# Altium project The_Robot.PrjPcb (part 1 of 2)
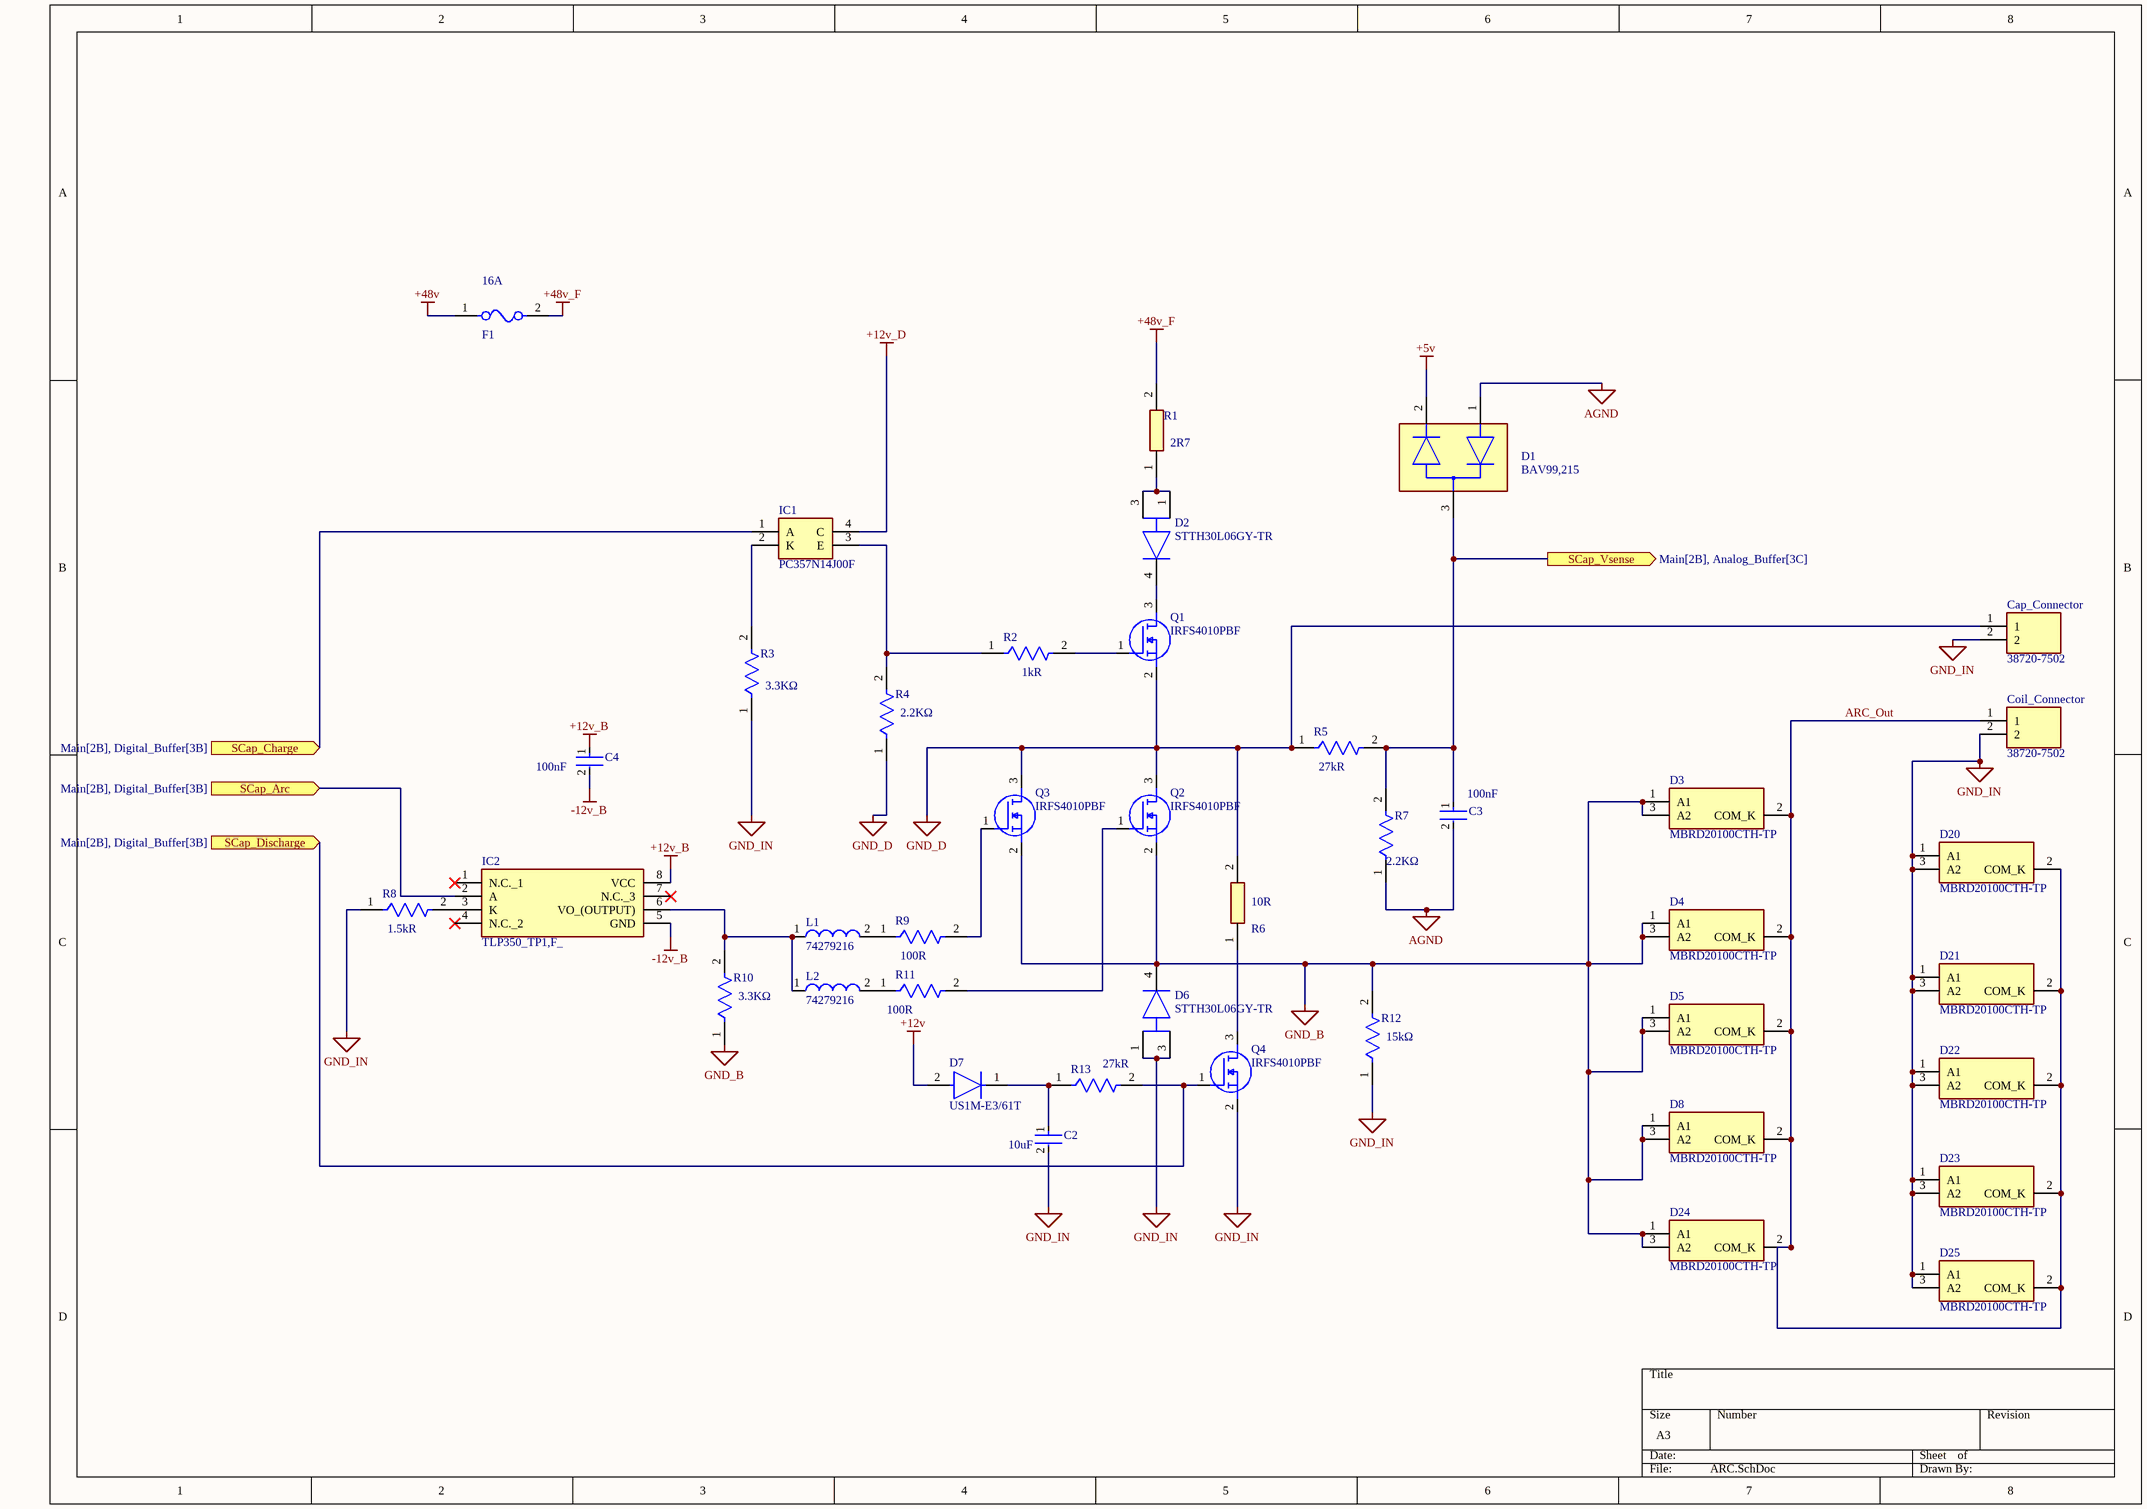
[diagram p0: ARC.SchDoc]
5 sheets, 205 parts. Net scope: hierarchical (ports join the sheet entries above them; power ports are global).
Board file: PCB2.PcbDoc
Sheets:
  ARC.SchDoc
  Power.SchDoc
  Microcontroller.SchDoc
  Digital_Buffer.SchDoc
  Analog_Buffer.SchDoc

## Sheet ARC.SchDoc
size A3; SheetNumber: 2; SheetTotal: 6

### Parts
C2  Capacitance: 10uF  [FP-GRM31C-0_2-e0_3_0_8-MFG]  (hidden comment: GRM31CR71E106KA12L)
C3  Capacitance: 100nF  [FP-1206-L_3_2_0_2-W_1_6_0-MFG]  (hidden comment: 12065C104KAT2A)
C4  Capacitance: 100nF  [FP-1206-L_3_2_0_2-W_1_6_0-MFG]  (hidden comment: 12065C104KAT2A)
Cap_Connector  38720-7502  [387207502]
Coil_Connector  38720-7502  [387207502]
D1  BAV99,215  [FP-SOT23-MFG]
D2  STTH30L06GY-TR  [FP-D2PAK-MFG]
D3  MBRD20100CTH-TP  [MBRD20100CTHTP]
D4  MBRD20100CTH-TP  [MBRD20100CTHTP]
D5  MBRD20100CTH-TP  [MBRD20100CTHTP]
D6  STTH30L06GY-TR  [FP-D2PAK-MFG]
D7  US1M-E3/61T  [FP-95400-MFG]
D8  MBRD20100CTH-TP  [MBRD20100CTHTP]
D20  MBRD20100CTH-TP  [MBRD20100CTHTP]
D21  MBRD20100CTH-TP  [MBRD20100CTHTP]
D22  MBRD20100CTH-TP  [MBRD20100CTHTP]
D23  MBRD20100CTH-TP  [MBRD20100CTHTP]
D24  MBRD20100CTH-TP  [MBRD20100CTHTP]
D25  MBRD20100CTH-TP  [MBRD20100CTHTP]
F1  Fuse Current: 16A  [FP-0031_8231-MFG]  (hidden comment: 0031.8231)
IC1  PC357N14J00F  [SOP254P675X300-4N]
IC2  TLP350_TP1,F_  [DIP762W60P254L966H485Q8N]
L1  74279216  [SMD-1206]
L2  74279216  [SMD-1206]
Q1  IRFS4010PBF  [IDB30E60]
Q2  IRFS4010PBF  [IDB30E60]
Q3  IRFS4010PBF  [IDB30E60]
Q4  IRFS4010PBF  [IDB30E60]
R1  value 2R7  [CP001027K00JE663]  (hidden comment: CP001010R00JE66)
R2  Resistance: 1kR  [FP-CR1206-IPC_A]  (hidden comment: CR1206-FX-1001ELF)
R3  value 3.3KΩ  [FP-CRGCQ1206-IPC_C]  (hidden comment: CRGCQ1206J3K3)
R4  value 2.2KΩ  [FP-CRGCQ1206-IPC_C]  (hidden comment: CRGCQ1206J2K2)
R5  Resistance: 27kR  [FP-RC3216-IPC_A]  (hidden comment: RC3216J273CS)
R6  value 10R  [CP001027K00JE663]  (hidden comment: CP001010R00JE66)
R7  value 2.2KΩ  [FP-CRGCQ1206-IPC_C]  (hidden comment: CRGCQ1206J2K2)
R8  Resistance: 1.5kR  [FP-CRCW1206-e3-IPC_C]  (hidden comment: CRCW12061K50FKEA)
R9  Resistance: 100R  [FP-CRCW1206-e3-MFG]  (hidden comment: CRCW1206100RFKEA)
R10  Resistance: 3.3KΩ  [FP-CRGCQ1206-IPC_C]  (hidden comment: CRGCQ1206F3K3)
R11  Resistance: 100R  [FP-CRCW1206-e3-MFG]  (hidden comment: CRCW1206100RFKEA)
R12  Resistance: 15kΩ  [FP-ERJ8EN-MFG]  (hidden comment: ERJ-8ENF1502V)
R13  Resistance: 27kR  [FP-RC3216-IPC_A]  (hidden comment: RC3216J273CS)

### Ports
SCap_Arc (in, see Main[2B], Digital_Buffer[3B]), SCap_Charge (in, see Main[2B], Digital_Buffer[3B]), SCap_Discharge (in, see Main[2B], Digital_Buffer[3B]), SCap_Vsense (out, see Main[2B], Analog_Buffer[3C])

### Nets
+5v: D1.2
+12v: D7.2(A)
+12v_B: C4.1 IC2.8(VCC)
+12v_D: IC1.4(C)
+48v: F1.1
+48v_F: F1.2 R1.2
-12v_B: C4.2 IC2.5(GND)
AGND: C3.2 D1.1 R7.1
GND_B: D3.1(A1) D3.3(A2) D4.1(A1) D4.3(A2) D5.1(A1) D5.3(A2) D6.4(K) D8.1(A1) D8.3(A2) D24.1(A1) D24.3(A2) Q2.2(S) Q3.2(S) R10.1 R12.2
GND_D: Cap_Connector.1 Q1.2(S) Q2.3(D) Q3.3(D) R4.1 R5.1 R6.2
GND_IN: C2.2 Cap_Connector.2 Coil_Connector.2 D6.1(A) D6.3(A) D20.1(A1) D20.3(A2) D21.1(A1) D21.3(A2) D22.1(A1) D22.3(A2) D23.1(A1) D23.3(A2) D25.1(A1) D25.3(A2) Q4.2(S) R3.1 R8.1 R12.1
ARC_Out: Coil_Connector.1 D3.2(COM_K) D4.2(COM_K) D5.2(COM_K) D8.2(COM_K) D20.2(COM_K) D21.2(COM_K) D22.2(COM_K) D23.2(COM_K) D24.2(COM_K) D25.2(COM_K)
SCap_Arc: IC2.2(A) ; port SCap_Arc
SCap_Charge: IC1.1(A) ; port SCap_Charge
SCap_Discharge: Q4.1(G) R13.2 ; port SCap_Discharge
SCap_Vsense: C3.1 D1.3 R5.2 R7.2 ; port SCap_Vsense
NetC2_1: C2.1 D7.1(C) R13.1
NetD2_1: D2.1(A) D2.3(A) R1.1
NetD2_4: D2.4(K) Q1.3(D)
NetIC1_2: IC1.2(K) R3.2
NetIC1_3: IC1.3(E) R2.1 R4.2
NetIC2_3: IC2.3(K) R8.2
NetIC2_6: IC2.6(VO_(OUTPUT)) L1.1 L2.1 R10.2
NetL1_2: L1.2 R9.1
NetL2_2: L2.2 R11.1
NetQ1_1: Q1.1(G) R2.2
NetQ2_1: Q2.1(G) R11.2
NetQ3_1: Q3.1(G) R9.2
NetQ4_3: Q4.3(D) R6.1

Not connected (* = marked no-connect by the designer): IC2 1(N.C._1)* 4(N.C._2)* 7(N.C._3)*

### Library data of the parts
C2 = CMP-06035-003589-1: Chip Multilayer Ceramic Capacitors for General Purpose, 1206, 10uF, X7R, 15%, 10%, 25V; Case Code (Imperial): 1206; Voltage Rating (DC): 25V; Voltage Rating: 25V; Length: 3.2mm; Lead Free: Lead Free; Thickness: 0.071inch; Package Quantity: 1; Width: 1.6mm; Max Operating Temperature: 125°C; Number of Pins: 2; Height: 1.6mm; Case Code (Metric): 3216; REACH SVHC: No SVHC; Radiation Hardening: No; Case/Package: 1206; Material: Ceramic; Tolerance: 10%; Voltage: 25V; Mount: Surface Mount; Packaging: Tape and Reel; Dielectric: X7R; Termination: SMD/SMT; Min Operating Temperature: -55°C; Depth: 1.6mm
C3 C4 = CMP-2000-05018-2: General Purpose Ceramic Capacitor, 1206, 100nF, 10%, X7R, 15%, 50V; Dissipation Factor: 2.5%; Insulation Resistance: 100GR; Dielectric: X7R; Thickness: 0.037inch; Case Code (Imperial): 1206; Case Code (Metric): 3216; Dielectric Material: Ceramic; Width: 1.6mm; Voltage Rating (DC): 50V; Termination: SMD/SMT; Tolerance: 10%; REACH SVHC: No SVHC; Height: 0.94mm; Length: 3.2mm; Voltage: 50V; Packaging: Tape and Reel; Depth: 1.6mm; Voltage Rating: 50V; Series: -; Contact Plating: Tin; Mount: Surface Mount; Package Quantity: 1; Construction: Flat; Max Operating Temperature: 125°C; Min Operating Temperature: -55°C; Case/Package: 1206; Lead Free: Lead Free; RoHS Compliant: Yes; Number of Pins: 2; Radiation Hardening: No
Cap_Connector Coil_Connector = 38720-7502: Connector; Manufacturer_Name: Molex; Datasheet Link: https://componentsearchengine.com/Datasheets/2/38720-7502.pdf; Height: 16.8mm; Manufacturer_Part_Number: 38720-7502; Mouser Part Number: 538-38720-7502; Mouser Price/Stock: https://www.mouser.co.uk/ProductDetail/Molex/38720-7502?qs=u6Gr9%2FNt%252B%2F8PORak8KlQTw%3D%3D
D1 = CMP-14399-000006-1: DIODE ARRAY GP 100V 215MA SOT23
D2 D6 = CMP-12188-000013-1: DIODE GEN PURP 600V 30A D2PAK; Manufacturer: STMicroelectronics; Automotive Grade: Grade 0; Max Junction Temp: +175°C; Standoff Height: 0.03mm; Max Surge Forward Current: 300A; Peak Reverse Current: 25uA; RoHS: TRUE; Temperature Range High: +175°C; ComponentLink2Description: Datasheet; Octopart: https://octopart.com/stth30l06gy-tr-stmicroelectronics-26451410; Manufacturer Part Number: STTH30L06GY-TR; Device Class L2: Diodes; Forward Current: 30A; Device Class L3: Rectifier Diodes; Digikey Description: DIODE GEN PURP 600V 30A D2PAK; Temperature: -40°C to +175°C; Temperature Range Low: -40°C; Max Repetitive Reverse Voltage: 600V; Category: Diode; Automotive: Yes; Package: D2PAK; Lead Free: Yes; Height: 4.83mm; Device Class L1: Discrete Semiconductors; ComponentLink2URL: https://www.st.com/resource/en/datasheet/stth30l06-y.pdf
D3-D5 D8 D20-D25 = MBRD20100CTH-TP: Schottky Diode; Manufacturer_Name: MCC; Datasheet Link: https://www.mccsemi.com/pdf/Products/MBRD20100CTH_MBRD20200CTH(DPAK).pdf; Height: 2.53mm; Manufacturer_Part_Number: MBRD20100CTH-TP; Mouser Part Number: 833-MBRD20100CTH-TP; Mouser Price/Stock: https://www.mouser.co.uk/ProductDetail/Micro-Commercial-Components-MCC/MBRD20100CTH-TP?qs=P1JMDcb91o6x6WEAXuWakg%3D%3D; Arrow Part Number: MBRD20100CTH-TP; Arrow Price/Stock: https://www.arrow.com/en/products/mbrd20100cth-tp/micro-commercial-components?region=europe
D7 = CMP-02540-000006-1: DIODE GEN PURP 1KV 1A DO214AC; Manufacturer: Vishay; Reverse Voltage: 1000V; Max Junction Temp: +150°C; Peak Reverse Current: 10uA; Max Surge Forward Current: 30A; Capacitance: 10pF; Standoff Height: 0mm; Value: 10pF; Temperature Range Low: -55°C; Footprint Url: https://www.vishay.com/docs/95400/sma.pdf; Device Class L1: Discrete Semiconductors; Temperature: -55°C to +150°C; Max Repetitive Reverse Voltage: 1000V; ComponentLink2URL: https://www.vishay.com/docs/88768/us1.pdf; Category: Diode; Octopart: https://octopart.com/us1m-e3%2F61t-vishay-39553152; Digikey Description: DIODE GEN PURP 1KV 1A DO214AC; Device Class L2: Diodes; ComponentLink2Description: Datasheet; Height: 2.29mm; Automotive: No; RoHS: TRUE; Mouser Description: On a Reel of 1800, Vishay 1000V 1A, Silicon Junction Diode, 2-Pin DO-214AC US1M-E3/61T; Package: 95400; Forward Current: 1A; Temperature Range High: +150°C; Device Class L3: Rectifier Diodes; Manufacturer Part Number: US1M-E3/61T; Lead Free: Yes
F1 = CMP-26292-000005-1: FUSE BLOK CARTRIDGE 600V 16A PCB; Manufacturer: Schurter; Voltage Rating Ac: 500V; Number Of Fuses: 1; Standoff Height: 0.7mm; Conn Orientation: Horizontal; ComponentLink2URL: https://www.schurter.com/en/datasheet/typ_OGD.pdf; Voltage Rating Dc: 600V; Package: 0; Device Class L3: unset; Digikey Description: FUSE BLOK CARTRIDGE 600V 16A PCB; Mouser Description: Fuse Holder OGD FUSEHOLDER 5X20/6.3X32; Category: Fuse; Device Class L2: Fuse Holders; Height: 12.7mm; ComponentLink2Description: Datasheet; Ambient Temperature Range Low: -40°C; Ambient Temperature Range High: +85°C; Octopart: https://octopart.com/0031.8231-schurter-8659; Automotive: No; RoHS: TRUE; Lead Free: Yes; Device Class L1: Circuit Protection; Manufacturer Part Number: 0031.8231
IC1 = PC357N14J00F: Integrated Circuit; Manufacturer_Name: Sharp Microelectronics; Height: 3mm; Manufacturer_Part_Number: PC357N14J00F
IC2 = TLP350_TP1,F_: Integrated Circuit; Manufacturer_Name: Toshiba; Manufacturer_Part_Number: TLP350(TP1,F); Datasheet Link: https://toshiba.semicon-storage.com/info/docget.jsp?did=6217&prodName=TLP350; Height: 4.85mm; Mouser Part Number: 757-TLP350(TP1,F); Mouser Price/Stock: https://www.mouser.co.uk/ProductDetail/Toshiba/TLP350TP1F?qs=f0GatGUIxV3mNWWzK5NBiQ%3D%3D; Arrow Part Number: TLP350(TP1,F); Arrow Price/Stock: https://www.arrow.com/en/products/tlp350-tp1f/toshiba?region=asia
L1 L2 = CMP-0220-00014-1: SMD EMI Suppression Ferrite Bead WE-CBF, Z = 1200 Ohm; PackageDescription: Chip Inductor, 2-Leads, Body 3.2 x 1.6 mm; PackageVersion: 2007; ComponentLink2URL: http://www.we-online.de/katalog/media/pdf/74279216.pdf; PackageReference: SMD-1206; ComponentLink2Description: Datasheet; ComponentLink1Description: Manufacturer Link; Impedance: 1200 Ohm; DatasheetVersion: Dec-2005; ComponentLink1URL: http://www.we-online.com
Q1-Q4 = IRFS4010PBF: MOSFET (N-Channel); Manufacturer_Name: Infineon; Datasheet Link: http://uk.rs-online.com/web/p/products/6887080; Manufacturer_Part_Number: IRFS4010PBF; Mouser Part Number: 942-IRFS4010PBF; Mouser Price/Stock: https://www.mouser.com/Search/Refine.aspx?Keyword=942-IRFS4010PBF
R1 R6 = CP001010R00JE66: Resistor; Manufacturer_Name: Vishay; Datasheet Link: https://www.vishay.com/docs/30113/cphivol.pdf; Height: 13.5mm; Manufacturer_Part_Number: CP001010R00JE66; Mouser Part Number: 71-CP001010R00JE66; Mouser Price/Stock: https://www.mouser.com/Search/Refine.aspx?Keyword=71-CP001010R00JE66; Arrow Part Number: CP001010R00JE66; Arrow Price/Stock: https://www.arrow.com/en/products/cp001010r00je66/vishay
R2 = CMP-07231-002641-1: Thick Film Chip Resistors 1206 1kΩ 0.25W 1% 100ppm/°C; Voltage Rating: 200V; Max Power Dissipation: 250mW; REACH SVHC: No SVHC; Radiation Hardening: No; Number of Terminations: 2; Max Operating Temperature: 155°C; Temperature Coefficient: 100ppm/°C; Voltage Rating (DC): 200V; Tolerance: 1%; Composition: Thick Film; Case Code (Imperial): 1206; Mount: Surface Mount; Width: 1.6mm; Min Operating Temperature: -55°C; Height: 0.6mm; Packaging: Tape and Reel; Number of Pins: 2; Package Quantity: 1; Military Standard: Not; Length: 3.2mm; Thickness: 610um; Case Code (Metric): 3216; Case/Package: 1206; Contact Plating: Tin; Power Rating: 250mW; Termination: SMD/SMT; Depth: 1.6mm; Features: Moisture Resistant
R3 = CMP-03211-010046-1: CRGCQ1206 3.3KΩ 0.25W 5% ±100ppm/°C 200V; Manufacturer: TE Connectivity; Tolerance: 0.05; Automotive Grade: Grade 800; Temperature Coefficient: ±100ppm/°C; Device Class L2: Resistors; Device Class L1: Passive Components; Octopart: https://octopart.com/crgcq1206j3k3-te+connectivity-91018329; Resistance: 3.3KΩ; Ambient Temperature Range High: +70°C; ComponentLink2URL: https://www.te.com/commerce/DocumentDelivery/DDEController?Action=showdoc&DocId=Data+Sheet%7F1773204-3%7F1%7Fpdf%7FEnglish%7FENG_DS_1773204-3_1.pdf%7F4-2176347-809; Device Class L3: Chip SMD Resistors; Manufacturer Part Number: CRGCQ1206J3K3; ComponentLink2Description: Datasheet; Height: 0.65mm; Lead Free: Yes; Power Rating: 0.25W; Category: Res; Temperature: -55°C to +155°C; Composition: Thick Film; Package: CRGCQ1206; Temperature Range High: +155°C; Voltage Rating: 200V; Temperature Range Low: -55°C; Automotive: Yes; RoHS: TRUE; Series: CRGCQ; Ipc Land Pattern Name: RESC310155X55
R4 R7 = CMP-03211-005605-1: CRGCQ 1206 2K2 5%; Manufacturer: TE Connectivity; Automotive Grade: Grade 758; Tolerance: 0.05; Voltage Rating: 200V; Temperature Coefficient: ±100ppm/°C; Power Rating: 0.25W; Device Class L2: Resistors; Lead Free: Yes; ComponentLink2URL: https://www.te.com/commerce/DocumentDelivery/DDEController?Action=showdoc&DocId=Data+Sheet%7F1773204-3%7F1%7Fpdf%7FEnglish%7FENG_DS_1773204-3_1.pdf%7F4-2176347-767; RoHS: TRUE; Resistance: 2.2KΩ; Category: Res; Series: CRGCQ; Height: 0.65mm; Digikey Description: CRGCQ 1206 2K2 5%; Manufacturer Part Number: CRGCQ1206J2K2; Temperature: -55°C to +155°C; ComponentLink2Description: Datasheet; Device Class L3: Chip SMD Resistors; Temperature Range Low: -55°C; Composition: Thick Film; Ambient Temperature Range High: +70°C; Temperature Range High: +155°C; Package: CRGCQ1206; Octopart: https://octopart.com/crgcq1206j2k2-te+connectivity-91018322; Device Class L1: Passive Components; Ipc Land Pattern Name: RESC310155X55; Automotive: Yes
R5 R13 = CMP-13261-004377-1: Res Thick Film 1206 27kΩ 5% 0.25W ±100ppm/°C Molded SMD T/R; Voltage Rating (DC): 200V; Max Power Dissipation: 250mW; Height: 0.026inch; Case Code (Imperial): 1206; Contact Plating: Tin; Features: Moisture Resistant; Case Code (Metric): 3216; Length: 0.126inch; Case/Package: 1206; Packaging: Tape and Reel; Temperature Coefficient: 100ppm/°C; Number of Terminations: 2; Min Operating Temperature: -55°C; Tolerance: 5%; Radiation Hardening: No; Composition: Thick Film; Width: 0.063inch; Lead Free: Lead Free; Max Operating Temperature: 155°C
R8 = CMP-02407-002229-1: RES Thick Film, 1.5kΩ, 1%, 0.25W, 100ppm/°C, 1206; Voltage Rating (DC): 200V; Power Rating: 250mW; Depth: 1.6mm; Case/Package: 1206; Packaging: Tape and Reel; Military Standard: Not; Radiation Hardening: No; Features: Automotive AEC-Q200; Number of Terminations: 2; Case Code (Imperial): 1206; Width: 0.063inch; Voltage Rating: 200V; Tolerance: 1%; Max Operating Temperature: 155°C; Weight: 0.000353oz; Package Quantity: 10; Temperature Coefficient: 100ppm/°C; Lead Free: Lead Free; Height: 0.024inch; Max Power Dissipation: 250mW; Termination: SMD/SMT; Length: 3.2mm; Contact Plating: Tin; Composition: Thick Film; Min Operating Temperature: -55°C; Case Code (Metric): 3216
R9 R11 = CMP-2003-04801-2: RES Thick Film, 100Ω, 1%, 0.25W, 100ppm/°C, 1206; Voltage Rating (DC): 200V; Power Rating: 250mW; Case Code (Metric): 3216; Radiation Hardening: No; Height: 0.55mm; Packaging: Tape and Reel; Depth: 1.6mm; Weight: 0.000353oz; Termination: SMD/SMT; Lead Free: Lead Free; Min Operating Temperature: -55°C; Contact Plating: Tin; Max Operating Temperature: 155°C; Case Code (Imperial): 1206; Military Standard: Not; Width: 1.6mm; Number of Pins: 2; Voltage Rating: 200V; Composition: Thick Film; Package Quantity: 5000; Tolerance: 1%; Case/Package: 1206; Mount: Surface Mount; Length: 3.2mm; Temperature Coefficient: 100ppm/°C
R10 = CMP-03211-006652-1: CRGCQ1206 3.3KΩ 0.25W 1% ±100ppm/°C 200V; Manufacturer: TE Connectivity; Tolerance: 0.01; Automotive Grade: Grade 799; Height: 0.65mm; Automotive: Yes; Device Class L3: Chip SMD Resistors; Category: Res; Ambient Temperature Range High: +70°C; Mouser Description: Res Thick Film 1206 3.3K Ohm 1% 0.25W(1/4W) ±100ppm/C Pad SMD Automotive T/R; Octopart: https://octopart.com/crgcq1206f3k3-te+connectivity-91018281; ComponentLink2Description: Datasheet; RoHS: TRUE; Package: CRGCQ1206; Temperature Range High: +155°C; Series: CRGCQ; Voltage Rating: 200V; Device Class L1: Passive Components; Temperature Range Low: -55°C; Manufacturer Part Number: CRGCQ1206F3K3; Temperature Coefficient: ±100ppm/°C; ComponentLink2URL: https://www.te.com/commerce/DocumentDelivery/DDEController?Action=showdoc&DocId=Data+Sheet%7F1773204-3%7F1%7Fpdf%7FEnglish%7FENG_DS_1773204-3_1.pdf%7F4-2176347-808; Composition: Thick Film; Ipc Land Pattern Name: RESC310155X55; Device Class L2: Resistors; Lead Free: Yes; Power Rating: 0.25W; Temperature: -55°C to +155°C; Value: 3.3KΩ
R12 = CMP-2003-00118-2: NexarPartId: 55423295; Voltage Rating: 200V; Temperature Coefficient: 100ppm/°C; Max Power Dissipation: 250mW; Tolerance: 1%; Military Standard: Not; Min Operating Temperature: -55°C; Height: 600µm; Termination: SMD/SMT; Composition: Thick Film; Mount: Surface Mount; Voltage Rating (DC): 200V; Lead Free: Lead Free; Features: Automotive AEC-Q200; Radiation Hardening: No; Number of Terminations: 2; Contact Plating: Tin; Lifecycle Status: Production; Schedule B: 8533210045, 8533210045; Max Operating Temperature: 155°C; Packaging: Cut Tape (CT); Length: 3.2mm; Power Rating: 250mW; Width: 1.6mm; RoHS: Compliant; Number of Pins: 2; Depth: 1.6mm; Case Code (Imperial): 1206; Case/Package: 1206; REACH SVHC: No SVHC; Case Code (Metric): 3216

## Sheet Power.SchDoc
size A2; SheetNumber: 3; SheetTotal: 6
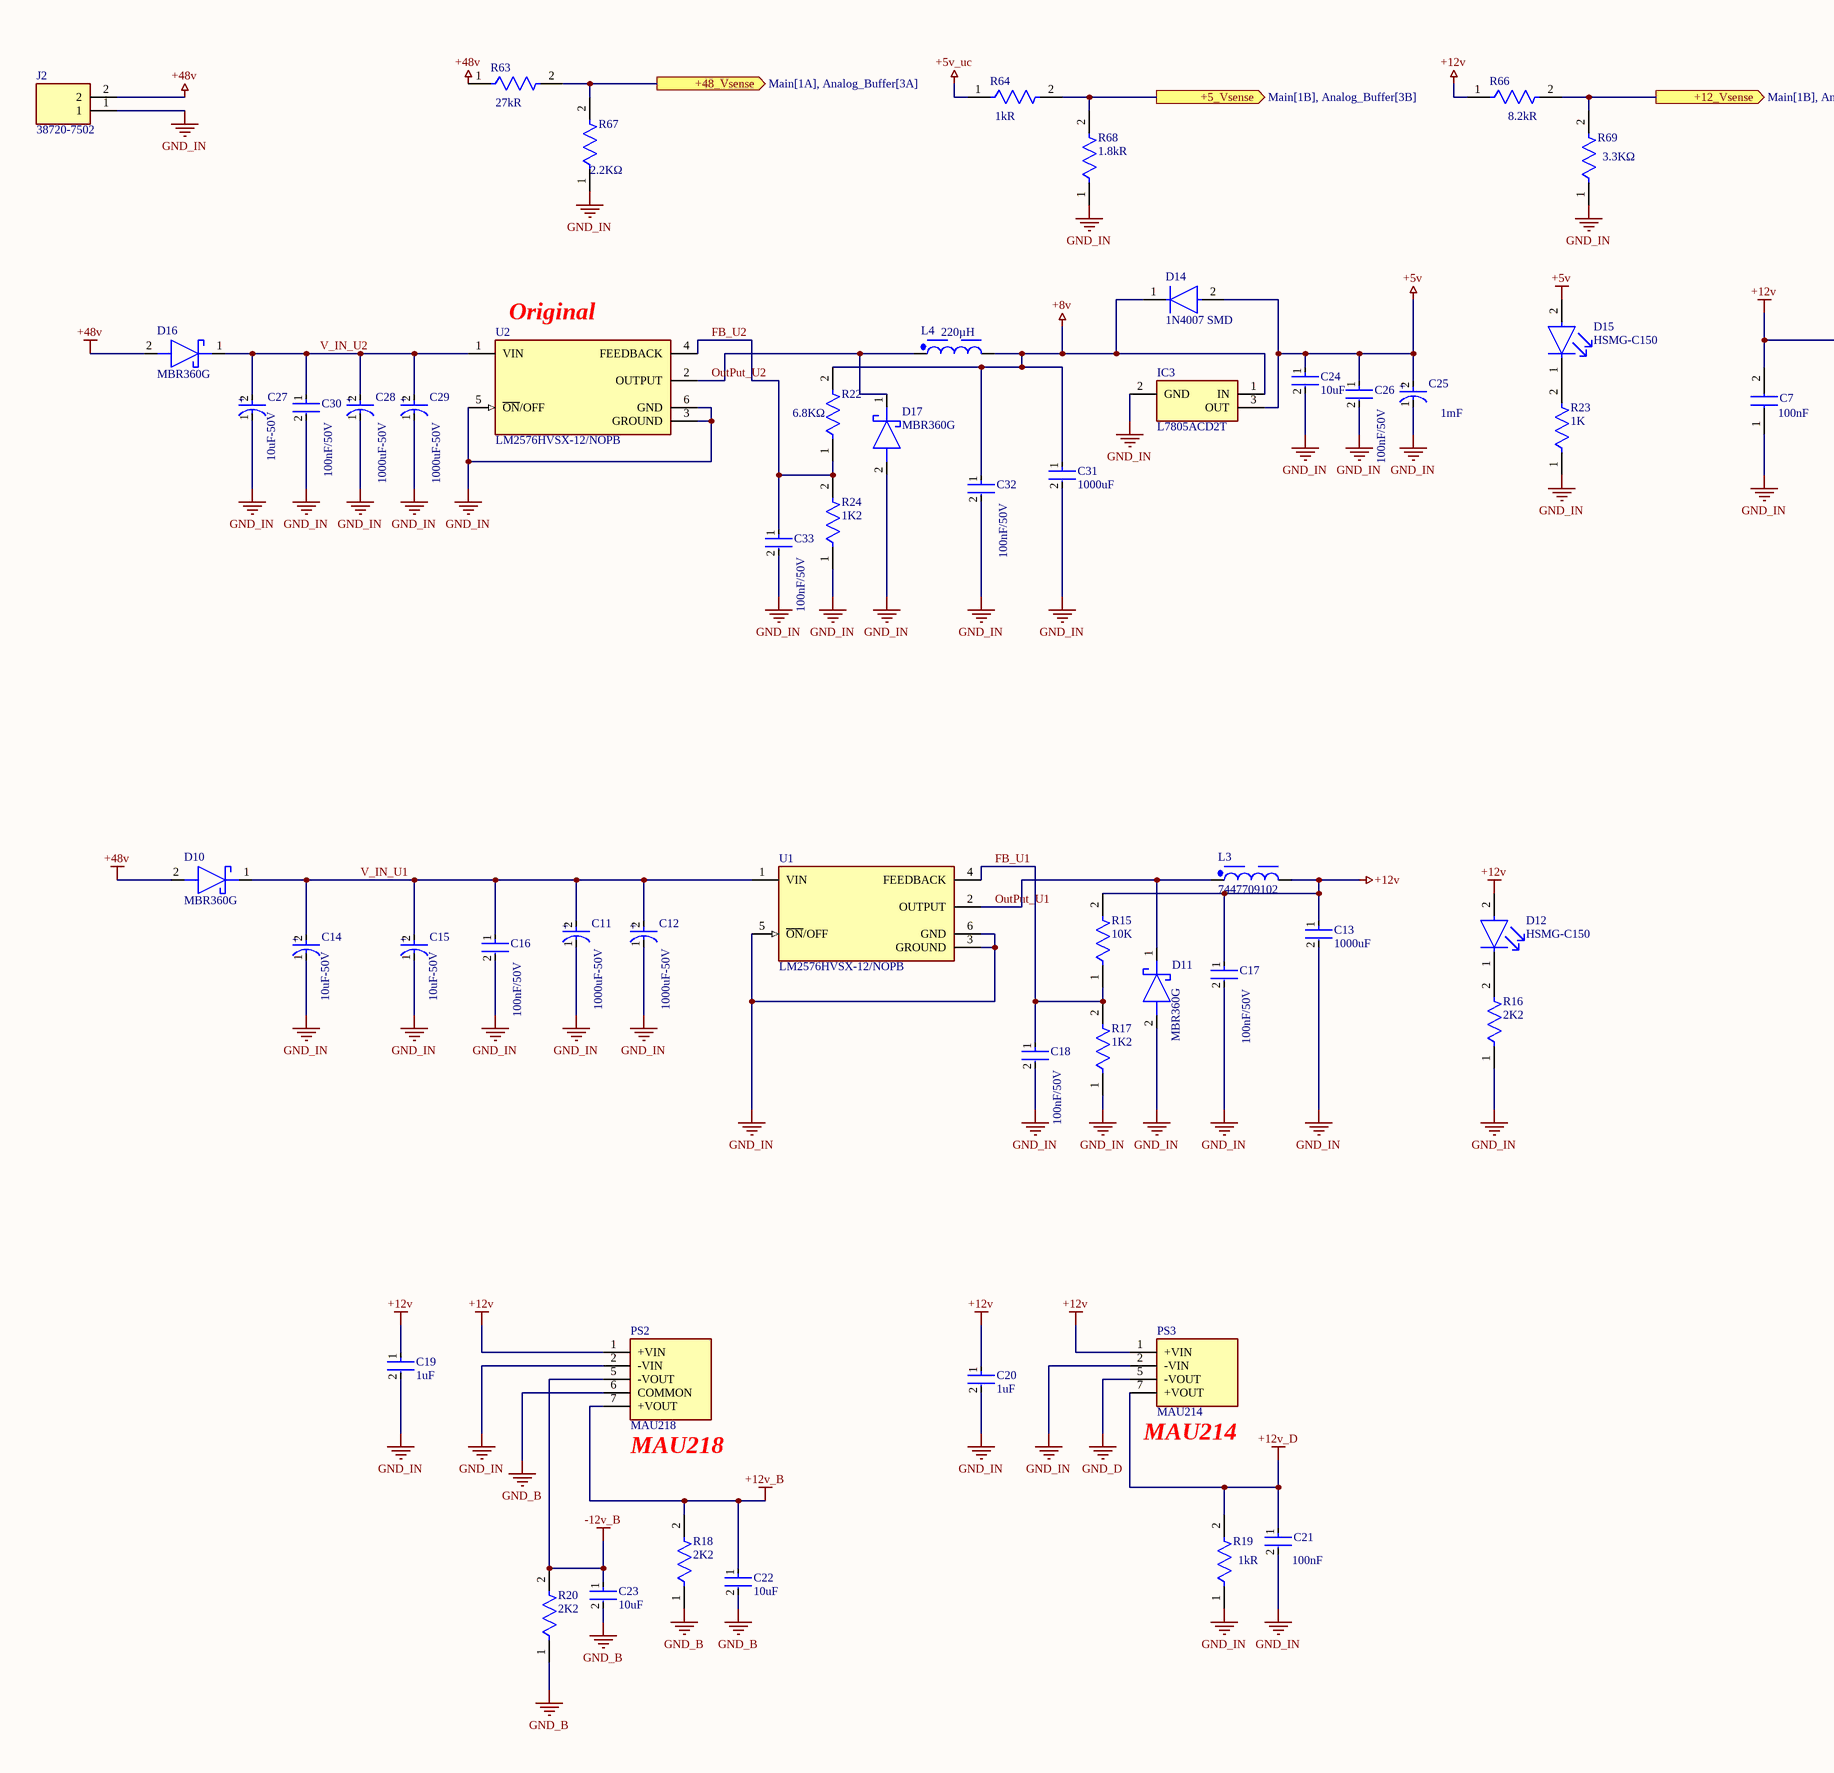
[diagram p1: Power.SchDoc, left]
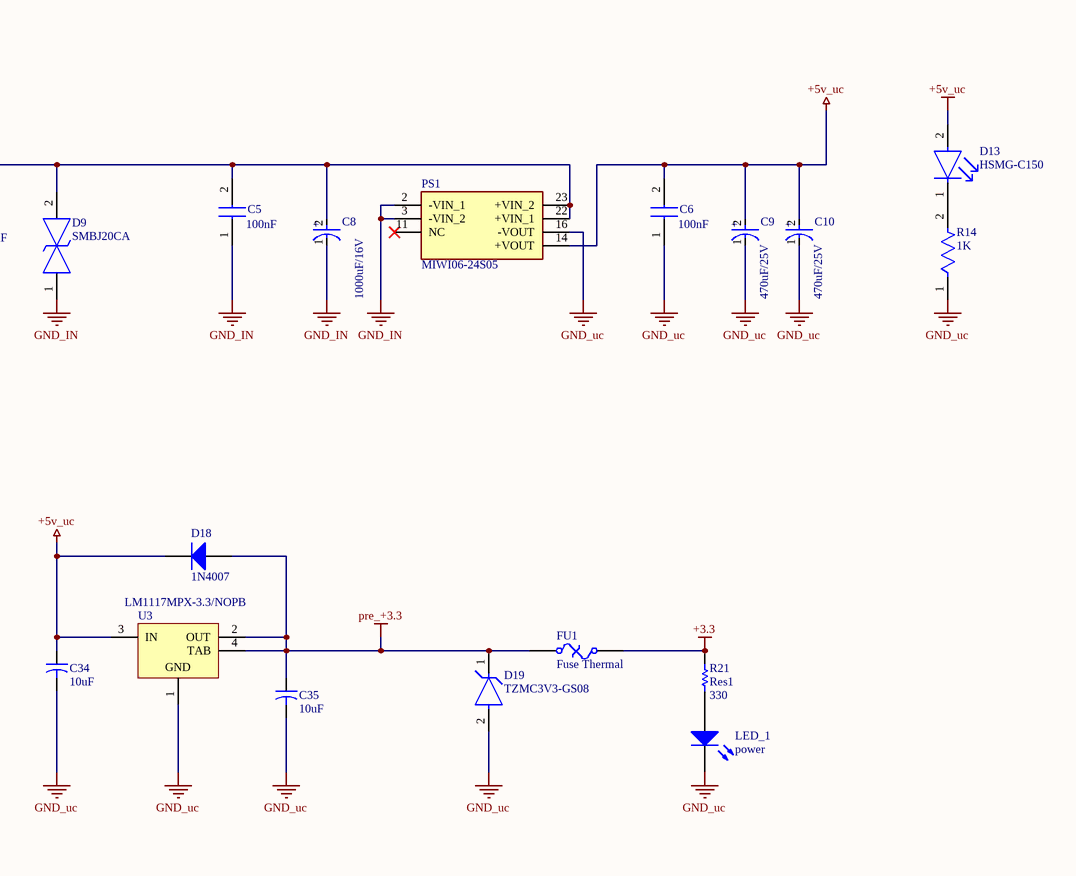
[diagram p2: Power.SchDoc, right]

### Parts
C5  100nF  [CAPC3216X95N]
C6  100nF  [CAPC3216X95N]
C7  100nF  [CAPC3216X95N]
C8  1000uF/16V  [FP-FTG-MFG]
C9  470uF/25V  [FP-FTF-MFG]
C10  470uF/25V  [FP-FTF-MFG]
C11  1000uF-50V  [FP-RAD-TH-D_12_5_0_5-L_25-MFG]
C12  1000uF-50V  [FP-RAD-TH-D_12_5_0_5-L_25-MFG]
C13  1000uF  [FP-C1206C-EB-MFG]
C14  10uF-50V  [FP-FKD-MFG]
C15  10uF-50V  [FP-FKD-MFG]
C16  100nF/50V  [FP-1206-L_3_2_0_2-W_1_6_0-MFG]
C17  100nF/50V  [FP-1206-L_3_2_0_2-W_1_6_0-MFG]
C18  100nF/50V  [FP-1206-L_3_2_0_2-W_1_6_0-MFG]
C19  1uF  [FP-1206-L_3_2_0_2-W_1_6_0-IPC_A]
C20  1uF  [FP-1206-L_3_2_0_2-W_1_6_0-IPC_A]
C21  Capacitance: 100nF  [FP-1206-L_3_2_0_2-W_1_6_0-MFG]  (hidden comment: 12065C104KAT2A)
C22  10uF  [FP-GRM31C-0_2-e0_3_0_8-MFG]
C23  10uF  [FP-GRM31C-0_2-e0_3_0_8-MFG]
C24  10uF  [FP-GRM31C-0_2-e0_3_0_8-MFG]
C25  Capacitance: 1mF  [FP-FTG-MFG]  (hidden comment: EEEFT1C102AP)
C26  100nF/50V  [FP-1206-L_3_2_0_2-W_1_6_0-MFG]
C27  10uF-50V  [FP-FKD-MFG]
C28  1000uF-50V  [FP-RAD-TH-D_12_5_0_5-L_25-MFG]
C29  1000uF-50V  [FP-RAD-TH-D_12_5_0_5-L_25-MFG]
C30  100nF/50V  [FP-1206-L_3_2_0_2-W_1_6_0-MFG]
C31  1000uF  [FP-C1206C-EB-MFG]
C32  100nF/50V  [FP-1206-L_3_2_0_2-W_1_6_0-MFG]
C33  100nF/50V  [FP-1206-L_3_2_0_2-W_1_6_0-MFG]
C34  value 10uF  [0805C]  (hidden comment: Cap_El)
C35  value 10uF  [0805C]  (hidden comment: Cap_El)
D9  SMBJ20CA  [DIOM5336X245N]
D10  MBR360G  [DIOAD2860W130L840D505]
D11  MBR360G  [DIOAD2860W130L840D505]
D12  HSMG-C150  [FP-HSMG-C150-MFG]
D13  HSMG-C150  [FP-HSMG-C150-MFG]
D14  1N4007 SMD  [FP-1N4007_SMD-IPC_C]
D15  HSMG-C150  [FP-HSMG-C150-MFG]
D16  MBR360G  [DIOAD2860W130L840D505]
D17  MBR360G  [DIOAD2860W130L840D505]
D18  1N4007  [430X270D]
D19  TZMC3V3-GS08  [FP-6_560-5005_01-4-MFG]
FU1  Fuse Thermal  [1206]
IC3  L7805ACD2T  [STB20N95K5]
J2  38720-7502  [387207502]
L3  7447709102  [WE-PD_1210]
L4  Inductance: 220µH  [WE-PD_1210]  (hidden comment: 7447709221)
LED_1  power  [0805LED]
PS1  MIWI06-24S05  [MIWI06_S]
PS2  MAU218  [MAU218]
PS3  MAU214  [MAU214]
R14  1K  [FP-CR1206-IPC_A]
R15  10K  [FP-CRCW1206-e3-IPC_C]
R16  2K2  [FP-CRGCQ1206-IPC_C]
R17  1K2  [FP-CRGCQ1206-IPC_C]
R18  2K2  [FP-CRGCQ1206-IPC_C]
R19  Resistance: 1kR  [FP-CR1206-IPC_A]  (hidden comment: CR1206-FX-1001ELF)
R20  2K2  [FP-CRGCQ1206-IPC_C]
R21  Res1  value 330  [0805L]
R22  value 6.8KΩ  [FP-CRGCQ1206-IPC_C]  (hidden comment: CRGCQ1206J6K8)
R23  1K  [FP-CR1206-IPC_A]
R24  1K2  [FP-CRGCQ1206-IPC_C]
R63  Resistance: 27kR  [FP-RC3216-IPC_A]  (hidden comment: RC3216J273CS)
R64  Resistance: 1kR  [FP-CR1206-IPC_A]  (hidden comment: CR1206-FX-1001ELF)
R66  Resistance: 8.2kR  [FP-CRCW1206-e3-IPC_A]  (hidden comment: CRCW12068K20FKEA)
R67  value 2.2KΩ  [FP-CRGCQ1206-IPC_C]  (hidden comment: CRGCQ1206J2K2)
R68  Resistance: 1.8kR  [FP-CRCW1206-e3-IPC_B]  (hidden comment: CRCW12061K80FKEA)
R69  value 3.3KΩ  [FP-CRGCQ1206-IPC_C]  (hidden comment: CRGCQ1206J3K3)
U1  LM2576HVSX-12/NOPB  [FP-KTT0005B-MFG]
U2  LM2576HVSX-12/NOPB  [FP-KTT0005B-MFG]
U3  LM1117MPX-3.3/NOPB  [DCY0004A_L]

### Ports
+5_Vsense (out, see Main[1B], Analog_Buffer[3B]), +12_Vsense (out, see Main[1B], Analog_Buffer[3B]), +48_Vsense (out, see Main[1A], Analog_Buffer[3A])

### Nets
+3.3: FU1.2 R21.1
+5v: C24.1 C25.2(A) C26.1 D14.2(A) D15.2(A) IC3.3(OUT)
+5v_uc: C6.2 C9.2(A) C10.2(A) C34.1 D13.2(A) D18.2(K) PS1.14(+VOUT) R64.1 U3.3(IN)
+8v: C31.1 C32.1 D14.1(C) IC3.1(IN) L4.2 R22.2
+12v: C5.2 C7.2 C8.2(A) C13.1 C17.1 C19.1 C20.1 D9.2 D12.2(A) L3.2 PS1.22(+VIN_1) PS1.23(+VIN_2) PS2.1(+VIN) PS3.1(+VIN) R15.2 R66.1
+12v_B: C22.1 PS2.7(+VOUT) R18.2
+12v_D: C21.1 PS3.7(+VOUT) R19.2
+48v: D10.2(A) D16.2(A) J2.2 R63.1
-12v_B: C23.1 PS2.5(-VOUT) R20.2
GND_B: C22.2 C23.2 PS2.6(COMMON) R18.1 R20.1
GND_D: PS3.5(-VOUT)
GND_IN: C5.1 C7.1 C8.1(C) C11.1(C) C12.1(C) C13.2 C14.1(C) C15.1(C) C16.2 C17.2 C18.2 C19.2 C20.2 C21.2 C24.2 C25.1(C) C26.2 C27.1(C) C28.1(C) C29.1(C) C30.2 C31.2 C32.2 C33.2 D9.1 D11.2(A) D17.2(A) IC3.2(GND) J2.1 PS1.2(-VIN_1) PS1.3(-VIN_2) PS2.2(-VIN) PS3.2(-VIN) R16.1 R17.1 R19.1 R23.1 R24.1 R67.1 R68.1 R69.1 U1.3(GROUND) U1.5(~{ON}/OFF) U1.6(GND) U2.3(GROUND) U2.5(~{ON}/OFF) U2.6(GND)
GND_uc: C6.1 C9.1(C) C10.1(C) C34.2 C35.2 D19.2(A) LED_1.2(K) PS1.16(-VOUT) R14.1 U3.1(GND)
pre_+3.3: C35.1 D18.1(A) D19.1(C) FU1.1 U3.2(OUT) U3.4(TAB)
+5_Vsense: R64.2 R68.2 ; port +5_Vsense
+12_Vsense: R66.2 R69.2 ; port +12_Vsense
+48_Vsense: R63.2 R67.2 ; port +48_Vsense
FB_U1: C18.1 R15.1 R17.2 U1.4(FEEDBACK)
FB_U2: C33.1 R22.1 R24.2 U2.4(FEEDBACK)
OutPut_U1: D11.1(K) L3.1 U1.2(OUTPUT)
OutPut_U2: D17.1(K) L4.1 U2.2(OUTPUT)
V_IN_U1: C11.2(A) C12.2(A) C14.2(A) C15.2(A) C16.1 D10.1(K) U1.1(VIN)
V_IN_U2: C27.2(A) C28.2(A) C29.2(A) C30.1 D16.1(K) U2.1(VIN)
NetD12_1: D12.1(C) R16.2
NetD13_1: D13.1(C) R14.2
NetD15_1: D15.1(C) R23.2
NetLED_1_1: LED_1.1(A) R21.2

Not connected (* = marked no-connect by the designer): PS1 11(NC)*

### Notes on the sheet
- (near U2) Original
- (near PS2) MAU218
- (near PS3) MAU214
- (in symbol CMP-2000-06207-2) +
- (in symbol CMP-05427-000040-1) +
- (in symbol CMP-05427-000086-1) +
- (in symbol CMP-05427-001975-1) +

### Library data of the parts
C5-C7 = GRM319F51H104ZA01D: Capacitor; Manufacturer_Name: Murata Electronics; Datasheet Link: http://www.murata.com/~/media/webrenewal/support/library/catalog/products/capacitor/mlcc/c02e.pdf; Height: 0.95mm; Manufacturer_Part_Number: GRM319F51H104ZA01D; Mouser Part Number: 81-GRM319F51H104ZA; Mouser Price/Stock: https://www.mouser.com/Search/Refine.aspx?Keyword=81-GRM319F51H104ZA; Arrow Part Number: GRM319F51H104ZA01D; Arrow Price/Stock: https://www.arrow.com/en/products/grm319f51h104za01d/murata-manufacturing
C8 = CMP-05427-000086-1: CAP ALUM 1000UF 20% 16V SMD; Life (Hours): 2000Hour; Ripple Current: 1.19A; Capacitance: 1mF; ESR (Equivalent Series Resistance): 60mR; Leakage Current: 160uA; Lead Diameter: 0.9mm; Height: 10.2mm; Radiation Hardening: No; Tolerance: 20%; Lead Free: Lead Free; Construction: Cylindrical; Voltage Rating (DC): 16V; Package Quantity: 1; REACH SVHC: No SVHC; Series: FT; Packaging: Tape and Reel; RoHS Compliant: Yes; Lead Pitch: 4.6mm; Diameter: 10mm; Voltage Rating: 16V; Height - Seated (Max): 0.413inch; Length: 10.2mm; Voltage: 16V; Max Operating Temperature: 105°C; Ripple Current (AC): 1.19A; Min Operating Temperature: -55°C; Termination: SMD/SMT; Mount: Surface Mount; Case/Package: Radial
C9 C10 = CMP-05427-000040-1: CAP ALUM 470UF 20% 25V SMD; ESR (Equivalent Series Resistance): 80mR; Dielectric Material: Aluminium; Lead Diameter: 0.9mm; Ripple Current: 850mA; Leakage Current: 117.5uA; Life (Hours): 2000Hour; Lead Free: Lead Free; Height - Seated (Max): 0.413inch; Contact Plating: Tin; Voltage: 25V; Package Quantity: 500; REACH SVHC: No SVHC; Diameter: 8mm; Features: General Purpose; Voltage Rating: 25V; Radiation Hardening: No; Number of Pins: 2; Length: 10.2mm; Max Operating Temperature: 105°C; Tolerance: 20%; Lead Pitch: 3.1mm; Voltage Rating (DC): 25V; Packaging: Tape and Reel; RoHS Compliant: Yes; Series: FT; Height: 10.2mm; Capacitance: 470uF; Construction: Cylindrical; Case/Package: Radial; Mount: Surface Mount; Termination: SMD/SMT; Min Operating Temperature: -55°C; Ripple Current (AC): 850mA
C11 C12 C28 C29 = CMP-05427-001975-1: Aluminum Electrolytic Capacitors (Radial Lead Type) 1000uF ±20% 50V; Lead Diameter: 0.6mm; Polarity: Polar; Lead/Base Style: Straight; Ripple Current: 1.05A; Life (Hours): 2000Hour; Dissipation Factor: 0.12%; Capacitance: 1mF; Diameter: 12.5mm; Height: 25mm; Construction: RADIAL; Voltage Rating (DC): 50V; Tolerance: 20%; Package Quantity: 200; Min Operating Temperature: -40°C; Packaging: Bulk; Max Operating Temperature: 85°C; Case/Package: Radial; Radiation Hardening: No; Mount: Through Hole; Length: 25mm; Termination: Radial; Voltage Rating: 50V; RoHS Compliant: Yes; Height - Seated (Max): 1.063inch; REACH SVHC: No SVHC; Series: M; Lead Pitch: 5mm
C13 C31 = CMP-1037-04222-2: CAP CER 0.1UF 200V 10% X7R 1206; Manufacturer Part Number: C1206C104K2RACTU; Manufacturer: KEMET; Automotive Grade: Grade 0; Tolerance: 0.1; Value: 0.10 μF; Material: Ceramic; Temperature Coefficient: 15%; Automotive: Yes; Temperature Characteristic: X7R; Digikey Description: CAP CER 0.1UF 200V 10% X7R 1206; ComponentLink2URL: https://content.kemet.com/datasheets/KEM_C1007_X8R_ULTRA_150C_SMD.pdf; Voltage Rating: 200 V; Temperature Range High: +150°C; Device Class L1: Passive Components; Octopart: https://octopart.com/c1206c104k2ractu-kemet-9138344; Temperature: -55°C to +150°C; Height: 0.88mm; Device Class L3: Ceramic Capacitors; Lead Free: Yes; Package: C1206C-EB; Category: Cap; Temperature Range Low: -55°C; Mouser Description: Multilayer Ceramic Capacitors MLCC - SMD/SMT 200volts 0.1uF X7R 10%; Ipc Land Pattern Name: CAPC320160X78; Capacitance: 0.10 μF; RoHS: TRUE; ComponentLink2Description: Datasheet; Device Class L2: Capacitors
C14 C15 C27 = CMP-2000-06207-2: CAP ALUM 10UF 20% 50V SMD; Impedance: 880mR; Ripple Current: 165mA; Polarity: Polar; Leakage Current: 3uA; Lead Diameter: 0.65mm; Life (Hours): 2000Hour; REACH SVHC: No SVHC; Series: FK; Max Operating Temperature: 105°C; Radiation Hardening: No; Size: 5.8mm; Ripple Current (AC): 165mA; Lead Free: Lead Free; Voltage: 50V; Contact Plating: Tin; Case/Package: Radial; RoHS Compliant: Yes; Voltage Rating: 50V; Height - Seated (Max): 0.24inch; Package Quantity: 1000; Termination: SMD/SMT; Number of Pins: 2; Mount: Surface Mount; Packaging: Tape and Reel; Length: 5.8mm; Width: 7.8mm; Min Operating Temperature: -55°C; Height: 5.8mm; ESR (Equivalent Series Resistance): 880mR; Capacitance: 10uF; Diameter: 6.3mm; Voltage Rating (DC): 50V; Construction: Cylindrical; Tolerance: 20%; Lead Pitch: 1.8mm
C16-C18 C26 C30 C32 C33 = CMP-2000-05018-2: General Purpose Ceramic Capacitor, 1206, 100nF, 50V; Dielectric: X7R; Tolerance: 10%; Dissipation Factor: 2.5%; Insulation Resistance: 100GR; Thickness: 0.037inch; Case Code (Imperial): 1206; Case Code (Metric): 3216; Dielectric Material: Ceramic; Width: 1.6mm; Voltage Rating (DC): 50V; Termination: SMD/SMT; REACH SVHC: No SVHC; Height: 0.94mm; Length: 3.2mm; Voltage: 50V; Capacitance: 100nF; Packaging: Tape and Reel; Depth: 1.6mm; Voltage Rating: 50V; Series: -; Contact Plating: Tin; Mount: Surface Mount; Package Quantity: 1; Construction: Flat; Max Operating Temperature: 125°C; Min Operating Temperature: -55°C; Case/Package: 1206; Lead Free: Lead Free; RoHS Compliant: Yes; Number of Pins: 2; Radiation Hardening: No
C19 C20 = CMP-2000-05866-2: General Purpose Ceramic Capacitor, 1206, 1uF, 10%, X7R, 15%, 50V; Dissipation Factor: 2.5%; Voltage: 25V; Dielectric: X7R; Radiation Hardening: No; Number of Pins: 2; Package Quantity: 1; Case Code (Metric): 3216; Thickness: 0.07inch; Voltage Rating (DC): 50V; Width: 0.063inch; Construction: Flat; Min Operating Temperature: -55°C; Length: 3.2mm; Voltage Rating: 50V; Case Code (Imperial): 1206; Height: 1.78mm; Capacitance: 1uF; REACH SVHC: No SVHC; Mount: Surface Mount; Max Operating Temperature: 125°C; Depth: 1.6mm; Packaging: Tape and Reel; Tolerance: 10%; Lead Free: Lead Free; Termination: SMD/SMT; RoHS Compliant: Yes; Case/Package: 1206; Contact Plating: Tin; Series: -
C21 = CMP-2000-05018-2: as C3 on sheet ARC; Dielectric: X7R; Thickness: 0.037inch; Case Code (Imperial): 1206; Case Code (Metric): 3216; Dielectric Material: Ceramic; Width: 1.6mm; Voltage Rating (DC): 50V; Termination: SMD/SMT; Tolerance: 10%; REACH SVHC: No SVHC; Height: 0.94mm; Length: 3.2mm; Voltage: 50V; Packaging: Tape and Reel; Depth: 1.6mm; Voltage Rating: 50V; Series: -; Contact Plating: Tin; Mount: Surface Mount; Package Quantity: 1; Construction: Flat; Max Operating Temperature: 125°C; Min Operating Temperature: -55°C; Case/Package: 1206; Lead Free: Lead Free; RoHS Compliant: Yes; Number of Pins: 2; Radiation Hardening: No
C22-C24 = CMP-06035-003589-1: as C2 on sheet ARC; Case Code (Imperial): 1206; Voltage Rating (DC): 25V; Voltage Rating: 25V; Length: 3.2mm; Lead Free: Lead Free; Thickness: 0.071inch; Package Quantity: 1; Width: 1.6mm; Max Operating Temperature: 125°C; Number of Pins: 2; Height: 1.6mm; Case Code (Metric): 3216; REACH SVHC: No SVHC; Radiation Hardening: No; Case/Package: 1206; Material: Ceramic; Tolerance: 10%; Voltage: 25V; Mount: Surface Mount; Packaging: Tape and Reel; Dielectric: X7R; Termination: SMD/SMT; Min Operating Temperature: -55°C; Capacitance: 10uF; Depth: 1.6mm
C25 = CMP-05427-000086-1: CAP ALUM 1000UF 20% 16V SMD; Life (Hours): 2000Hour; Ripple Current: 1.19A; ESR (Equivalent Series Resistance): 60mR; Leakage Current: 160uA; Lead Diameter: 0.9mm; Height: 10.2mm; Radiation Hardening: No; Tolerance: 20%; Lead Free: Lead Free; Construction: Cylindrical; Voltage Rating (DC): 16V; Package Quantity: 1; REACH SVHC: No SVHC; Series: FT; Packaging: Tape and Reel; RoHS Compliant: Yes; Lead Pitch: 4.6mm; Diameter: 10mm; Voltage Rating: 16V; Height - Seated (Max): 0.413inch; Length: 10.2mm; Voltage: 16V; Max Operating Temperature: 105°C; Ripple Current (AC): 1.19A; Min Operating Temperature: -55°C; Termination: SMD/SMT; Mount: Surface Mount; Case/Package: Radial
C34 C35 = Cap_El: Capacitor; Published: 23-Sep-2002; PackageReference: CAPR5-4X5; Publisher: Altium Limited
D9 = SMBJ20CA: TVS Diode (Bi-directional); Manufacturer_Name: onsemi; Datasheet Link: https://componentsearchengine.com/Datasheets/1/SMBJ20CA.pdf; Height: 2.45mm; Manufacturer_Part_Number: SMBJ20CA; Mouser Part Number: 512-SMBJ20CA; Mouser Price/Stock: https://www.mouser.co.uk/ProductDetail/onsemi-Fairchild/SMBJ20CA?qs=iN0KuJO79Ka3il%2FXEzRA3A%3D%3D; Arrow Part Number: SMBJ20CA; Arrow Price/Stock: https://www.arrow.com/en/products/smbj20ca/on-semiconductor
D10 D11 D16 D17 = MBR360G: Schottky Diode; Manufacturer_Name: onsemi; Datasheet Link: https://www.onsemi.com/pub/Collateral/MBR350-D.PDF; Manufacturer_Part_Number: MBR360G; Mouser Part Number: 863-MBR360G; Mouser Price/Stock: https://www.mouser.co.uk/ProductDetail/onsemi/MBR360G?qs=3JMERSakebrDB2Vj%252Bnts6A%3D%3D; Arrow Part Number: MBR360G; Arrow Price/Stock: https://www.arrow.com/en/products/mbr360g/on-semiconductor?region=nac
D12 D13 D15 = CMP-2000-05061-2: LED GREEN DIFFUSED 1206 SMD; Manufacturer: Broadcom; Led Orientation: Top View; Max Junction Temp: +95°C; Peak Emmision Wavelength: 570nm; Viewing Angle: 170°; Wavelength: 572nm; Reverse Voltage: 5V; Luminous Intensity: 15mcd; Forward Voltage: 2.2V; Power Dissipation: 65mW; Forward Current: 20mA; ComponentLink2Description: Datasheet; Lead Free: Yes; Temperature Range Low: -40°C; Package: HSMG-C150; Digikey Description: LED GREEN DIFFUSED 1206 SMD; Mouser Description: LED Uni-Color Green 570nm 2-Pin Chip LED T/R; Manufacturer Part Number: HSMG-C150; Temperature Range High: +85°C; Device Class L1: Optoelectronics; Colour: Green; Category: Diode; Device Class L3: unset; RoHS: TRUE; Height: 1.2mm; ComponentLink2URL: https://docs.broadcom.com/docs/AV02-0551EN; Device Class L2: LEDs; Automotive: No; Ipc Land Pattern Name: DIOCP320160X55; Octopart: https://octopart.com/hsmg-c150-broadcom-71131304; Temperature: -40°C to +85°C
D14 = CMP-12389-000001-1: Rectifier, 1Kv, 1A, Do-214Ac Rohs Compliant: Yes
D18 = Diode: 1 Amp General Purpose Rectifier; Revision 1: 11-Jul-2000: SIM Model Added.; Revision 2: 17-Jul-2002: Re-released for DXP Platform.; Package Information: Latest Revision: Aug-1999; Code - JEDEC: DO-204-AL; Published: 8-Jun-2000; Datasheet: Latest Revision: 1998; Package Reference: DO-41; Publisher: Altium Limited
D19 = CMP-02541-000008-1: DIODE ZENER 3.3V 500MW SOD80; Manufacturer: Vishay; Reverse Voltage: 1V; Max Junction Temp: +175°C; Max Zener Voltage: 3.5V; Zener Impedance: 90Ω; Max Reverse Leakage Current: 2uA; Forward Current: 200mA; Automotive Grade: Grade 0; ComponentLink2Description: Datasheet; Category: Diode; ComponentLink2URL: http://www.vishay.com/docs/84122/tzm.pdf; Lead Free: Yes; Device Class L2: Diodes; Digikey Description: DIODE ZENER 3.3V 500MW SOD80; Mouser Description: Zener Diodes 3.3 Volt 0.5 Watt; Device Class L1: Discrete Semiconductors; Package: 6.560-5005.01-4; Device Class L3: Zener Diodes; Manufacturer Part Number: TZMC3V3-GS08; Temperature Range High: +175°C; Height: 1.6mm; Automotive: Yes; Temperature: to +175°C; RoHS: TRUE; Nom Zener Voltage: 3.3V; Octopart: https://octopart.com/tzmc3v3-gs08-vishay-55388698; Power Dissipation: 500mW
FU1 = Fuse Thermal: Thermal Fuse; Published: 24-Mar-1999; LatestRevisionDate: 17-Jul-2002; LatestRevisionNote: Re-released for DXP Platform.; PackageReference: PIN-W2/E2.8; Publisher: Altium Limited; PackageDescription: Thru-Hole; 2 Leads
IC3 = L7805ACD2T: Integrated Circuit; Manufacturer_Name: STMicroelectronics; Datasheet Link: https://componentsearchengine.com/Datasheets/1/L7805ACD2T.pdf; Height: 4mm; Manufacturer_Part_Number: L7805ACD2T; Mouser Part Number: 511-L7805ACD2T; Mouser Price/Stock: https://www.mouser.co.uk/ProductDetail/STMicroelectronics/L7805ACD2T?qs=f9uBznyCLhZ5tRIsM0TDkA%3D%3D
J2 = 38720-7502: Connector; Manufacturer_Name: Molex; Datasheet Link: https://componentsearchengine.com/Datasheets/2/38720-7502.pdf; Height: 16.8mm; Manufacturer_Part_Number: 38720-7502; Mouser Part Number: 538-38720-7502; Mouser Price/Stock: https://www.mouser.co.uk/ProductDetail/Molex/38720-7502?qs=u6Gr9%2FNt%252B%2F8PORak8KlQTw%3D%3D
L3 = CMP-0227-00036-2: NexarPartId: 8917171; Test Frequency: 1kHz; Max DC Current: 900mA; Self Resonant Frequency: 1MHz; Core Material: Ferrite; Resistance: 1.2Ω; Inductance: 1mH; DC Resistance (DCR): 930mΩ; Inductance Tolerance: 20%; Shielding: Shielded; Saturation Current: 1A; Weight: 4.535924g; Case/Package: Nonstandard; Packaging: Digi-Reel®; REACH SVHC: Unknown; Width: 12mm; Height - Seated (Max): 10.0076mm; Max Operating Temperature: 125°C; Lead Pitch: 7mm; Number of Pins: 2; Case Code (Imperial): 1210; Height: 10mm; Length: 12mm; RMS Current (Irms): 900mA; Depth: 12mm; Min Operating Temperature: -40°C; Series Resistance: 1.2Ω; Current Rating: 900mA; Composition: Wirewound; Ambient Temperature Range High: 85°C; Case Code (Metric): 3225; Termination: SMD/SMT; RoHS: Compliant; Tolerance: 20%; Mount: Surface Mount; Ambient Temperature Range Low: -40°C
L4 = CMP-0227-00173-2: NexarPartId: 8917168; Test Frequency: 1kHz; Resistance: 300mΩ; Max DC Current: 1.8A; Shielding: Shielded; Inductance Tolerance: 20%; DC Resistance (DCR): 193mΩ; Self Resonant Frequency: 2.2MHz; Saturation Current: 2.2A; Core Material: Ferrite; Height - Seated (Max): 10.0076mm; Case Code (Imperial): 1210; Ambient Temperature Range High: 85°C; Lead Pitch: 7mm; Case/Package: Nonstandard; RMS Current (Irms): 1.8A; Min Operating Temperature: -40°C; Current Rating: 1.8A; Lead Free: Lead Free; RoHS: Compliant; Ambient Temperature Range Low: -40°C; REACH SVHC: Unknown; Case Code (Metric): 3225; Weight: 4.535924g; Max Operating Temperature: 125°C; Series Resistance: 300mΩ; Depth: 12mm; Number of Pins: 2; Termination: SMD/SMT; Length: 12mm; Mount: Surface Mount; Width: 12mm; Height: 10mm; Packaging: Cut Tape (CT); Tolerance: 20%; Composition: Wirewound
LED_1 = LED3: Typical BLUE SiC LED; Published: 8-Jun-2000; LatestRevisionDate: 17-Dec-2003; LatestRevisionNote: PCB Footprint replaced.; DatasheetDocument: 16-Apr-2002; PackageDocument: 16-Apr-2002; PackageReference: 3.5X2.8X1.9; Publisher: Altium Limited
PS1 = MIWI06-24S05: Power Supply; Manufacturer_Name: Minmax; Datasheet Link: https://www.minmaxpower.com/storage/media/Product-MINMAX/MIWI06/MIWI06_Datasheet.pdf; Manufacturer_Part_Number: MIWI06-24S05
PS2 = MAU218: Power Supply; Manufacturer_Name: Minmax; Datasheet Link: https://www.minmaxpower.com/storage/media/Product-MINMAX/MAU200/Document/MAU200_Datasheet.pdf; Height: 10.45mm; Manufacturer_Part_Number: MAU218
PS3 = MAU214: Power Supply; Manufacturer_Name: Minmax; Datasheet Link: https://www.minmaxpower.com/storage/media/Product-MINMAX/MAU200/Document/MAU200_Datasheet.pdf; Height: 10.45mm; Manufacturer_Part_Number: MAU214
R14 R23 = CMP-07231-002641-1: Thick Film Chip Resistors 1206 1kΩ 0.25W 1% 100ppm/°C; Voltage Rating: 200V; Max Power Dissipation: 250mW; Resistance: 1kR; REACH SVHC: No SVHC; Radiation Hardening: No; Number of Terminations: 2; Max Operating Temperature: 155°C; Temperature Coefficient: 100ppm/°C; Voltage Rating (DC): 200V; Tolerance: 1%; Composition: Thick Film; Case Code (Imperial): 1206; Mount: Surface Mount; Width: 1.6mm; Min Operating Temperature: -55°C; Height: 0.6mm; Packaging: Tape and Reel; Number of Pins: 2; Package Quantity: 1; Military Standard: Not; Length: 3.2mm; Thickness: 610um; Case Code (Metric): 3216; Case/Package: 1206; Contact Plating: Tin; Power Rating: 250mW; Termination: SMD/SMT; Depth: 1.6mm; Features: Moisture Resistant
R15 = CMP-2003-04807-2: RES Thick Film, 10kΩ, 1%, 0.25W, 100ppm/°C, 1206; Working Voltage: 200V; Max Power Dissipation: 250mW; Resistance: 10kR; Tolerance: 1%; Width: 0.063inch; Height: 0.55mm; Number of Pins: 2; Voltage Rating: 200V; Temperature Coefficient: 100ppm/°C; Military Standard: Not; Features: Automotive AEC-Q200; Depth: 1.6mm; Radiation Hardening: No; Termination: SMD/SMT; Case Code (Imperial): 1206; Weight: 0.000353oz; Length: 3.2mm; Package Quantity: 10; Voltage Rating (DC): 200V; Case/Package: 1206; Min Operating Temperature: -55°C; Number of Terminations: 2; Composition: Thick Film; Contact Plating: Tin; Power Rating: 250mW; Packaging: Tape and Reel; Max Operating Temperature: 155°C; Lead Free: Lead Free; Case Code (Metric): 3216
R16 R18 R20 = CMP-03211-005605-1: CRGCQ 1206 2K2 5%; Manufacturer Part Number: CRGCQ1206J2K2; Manufacturer: TE Connectivity; Value: 2.2KΩ; Automotive Grade: Grade 758; Tolerance: 0.05; Voltage Rating: 200V; Temperature Coefficient: ±100ppm/°C; Power Rating: 0.25W; Device Class L2: Resistors; Lead Free: Yes; ComponentLink2URL: https://www.te.com/commerce/DocumentDelivery/DDEController?Action=showdoc&DocId=Data+Sheet%7F1773204-3%7F1%7Fpdf%7FEnglish%7FENG_DS_1773204-3_1.pdf%7F4-2176347-767; RoHS: TRUE; Resistance: 2.2KΩ; Category: Res; Series: CRGCQ; Height: 0.65mm; Digikey Description: CRGCQ 1206 2K2 5%; Temperature: -55°C to +155°C; ComponentLink2Description: Datasheet; Device Class L3: Chip SMD Resistors; Temperature Range Low: -55°C; Composition: Thick Film; Ambient Temperature Range High: +70°C; Temperature Range High: +155°C; Package: CRGCQ1206; Octopart: https://octopart.com/crgcq1206j2k2-te+connectivity-91018322; Device Class L1: Passive Components; Ipc Land Pattern Name: RESC310155X55; Automotive: Yes
R17 R24 = CMP-03211-007361-1: CRGCQ 1206 1K2 1%; Manufacturer: TE Connectivity; Manufacturer Part Number: CRGCQ1206F1K2; Temperature Coefficient: ±100ppm/°C; Automotive Grade: Grade 701; Tolerance: 0.01; Value: 1.2KΩ; Power Rating: 0.25W; Voltage Rating: 200V; ComponentLink2URL: https://www.te.com/commerce/DocumentDelivery/DDEController?Action=showdoc&DocId=Data+Sheet%7F1773204-3%7F1%7Fpdf%7FEnglish%7FENG_DS_1773204-3_1.pdf%7F4-2176347-710; Digikey Description: CRGCQ 1206 1K2 1%; Temperature Range Low: -55°C; Ipc Land Pattern Name: RESC310155X55; Package: CRGCQ1206; RoHS: TRUE; Octopart: https://octopart.com/crgcq1206f1k2-te+connectivity-91018259; Composition: Thick Film; ComponentLink2Description: Datasheet; Device Class L2: Resistors; Height: 0.65mm; Lead Free: Yes; Category: Res; Automotive: Yes; Temperature Range High: +155°C; Ambient Temperature Range High: +70°C; Temperature: -55°C to +155°C; Device Class L3: Chip SMD Resistors; Mouser Description: Res Thick Film 1206 1.2K Ohm 1% 0.25W(1/4W) ±100ppm/C Pad SMD Automotive T/R; Resistance: 1.2KΩ; Series: CRGCQ; Device Class L1: Passive Components
R19 R64 = CMP-07231-002641-1: as R2 on sheet ARC; REACH SVHC: No SVHC; Radiation Hardening: No; Number of Terminations: 2; Max Operating Temperature: 155°C; Temperature Coefficient: 100ppm/°C; Voltage Rating (DC): 200V; Tolerance: 1%; Composition: Thick Film; Case Code (Imperial): 1206; Mount: Surface Mount; Width: 1.6mm; Min Operating Temperature: -55°C; Height: 0.6mm; Packaging: Tape and Reel; Number of Pins: 2; Package Quantity: 1; Military Standard: Not; Length: 3.2mm; Thickness: 610um; Case Code (Metric): 3216; Case/Package: 1206; Contact Plating: Tin; Power Rating: 250mW; Termination: SMD/SMT; Depth: 1.6mm; Features: Moisture Resistant
R21 = Res1: Resistor; Published: 8-Jun-2000; LatestRevisionDate: 17-Jul-2002; LatestRevisionNote: Re-released for DXP Platform.; PackageReference: AXIAL-0.3; Publisher: Altium Limited
R22 = CMP-03211-007534-1: CRGCQ1206 6.8KΩ 0.25W 5% ±100ppm/°C 200V; Manufacturer: TE Connectivity; Tolerance: 0.05; Automotive Grade: Grade 876; Series: CRGCQ; Device Class L2: Resistors; Voltage Rating: 200V; Power Rating: 0.25W; Temperature Range Low: -55°C; Temperature: -55°C to +155°C; ComponentLink2Description: Datasheet; Octopart: https://octopart.com/crgcq1206j6k8-te+connectivity-91018343; Lead Free: Yes; Ambient Temperature Range High: +70°C; Temperature Range High: +155°C; Height: 0.65mm; Temperature Coefficient: ±100ppm/°C; ComponentLink2URL: https://www.te.com/commerce/DocumentDelivery/DDEController?Action=showdoc&DocId=Data+Sheet%7F1773204-3%7F1%7Fpdf%7FEnglish%7FENG_DS_1773204-3_1.pdf%7F4-2176347-885; Composition: Thick Film; Manufacturer Part Number: CRGCQ1206J6K8; Ipc Land Pattern Name: RESC310155X55; Device Class L3: Chip SMD Resistors; Automotive: Yes; RoHS: TRUE; Resistance: 6.8KΩ; Category: Res; Package: CRGCQ1206; Device Class L1: Passive Components
R63 = CMP-13261-004377-1: as R5 on sheet ARC; Height: 0.026inch; Case Code (Imperial): 1206; Contact Plating: Tin; Features: Moisture Resistant; Case Code (Metric): 3216; Length: 0.126inch; Case/Package: 1206; Packaging: Tape and Reel; Temperature Coefficient: 100ppm/°C; Number of Terminations: 2; Min Operating Temperature: -55°C; Tolerance: 5%; Radiation Hardening: No; Composition: Thick Film; Width: 0.063inch; Lead Free: Lead Free; Max Operating Temperature: 155°C
R66 = CMP-2003-02417-2: RES Thick Film, 8.2kΩ, 1%, 0.25W, 100ppm/°C, 1206; Power Rating: 250mW; Voltage Rating (DC): 200V; Features: Automotive AEC-Q200; Package Quantity: 10; Width: 1.6mm; Case/Package: 1206; Number of Terminations: 2; Composition: Thick Film; Case Code (Metric): 3216; Lead Free: Lead Free; Termination: SMD/SMT; Min Operating Temperature: -55°C; Length: 3.2mm; Case Code (Imperial): 1206; Depth: 1.6mm; Military Standard: Not; Radiation Hardening: No; Tolerance: 1%; Voltage Rating: 200V; Max Operating Temperature: 155°C; Height: 0.55mm; Temperature Coefficient: 100ppm/°C; Packaging: Tape and Reel; Weight: 0.000353oz; Max Power Dissipation: 250mW; Contact Plating: Tin
R67 = CMP-03211-005605-1: as R4 on sheet ARC; Device Class L2: Resistors; Lead Free: Yes; ComponentLink2URL: https://www.te.com/commerce/DocumentDelivery/DDEController?Action=showdoc&DocId=Data+Sheet%7F1773204-3%7F1%7Fpdf%7FEnglish%7FENG_DS_1773204-3_1.pdf%7F4-2176347-767; RoHS: TRUE; Resistance: 2.2KΩ; Category: Res; Series: CRGCQ; Height: 0.65mm; Digikey Description: CRGCQ 1206 2K2 5%; Manufacturer Part Number: CRGCQ1206J2K2; Temperature: -55°C to +155°C; ComponentLink2Description: Datasheet; Device Class L3: Chip SMD Resistors; Temperature Range Low: -55°C; Composition: Thick Film; Ambient Temperature Range High: +70°C; Temperature Range High: +155°C; Package: CRGCQ1206; Octopart: https://octopart.com/crgcq1206j2k2-te+connectivity-91018322; Device Class L1: Passive Components; Ipc Land Pattern Name: RESC310155X55; Automotive: Yes
R68 = CMP-2003-01900-2: RES Thick Film, 1.8kΩ, 1%, 0.25W, 100ppm/°C, 1206; Power Rating: 250mW; Voltage Rating (DC): 200V; Case Code (Imperial): 1206; Case/Package: 1206; Packaging: Tape and Reel; Radiation Hardening: No; Max Operating Temperature: 155°C; Weight: 0.000353oz; Features: Automotive AEC-Q200; Lead Free: Lead Free; Case Code (Metric): 3216; Temperature Coefficient: 100ppm/°C; Length: 3.2mm; Termination: SMD/SMT; Height: 0.55mm; Military Standard: Not; Min Operating Temperature: -55°C; Package Quantity: 10; Number of Terminations: 2; Composition: Thick Film; Contact Plating: Tin; Tolerance: 1%; Max Power Dissipation: 250mW; Width: 0.063inch; Depth: 1.6mm; Voltage Rating: 200V
R69 = CMP-03211-010046-1: as R3 on sheet ARC; Temperature Coefficient: ±100ppm/°C; Device Class L2: Resistors; Device Class L1: Passive Components; Octopart: https://octopart.com/crgcq1206j3k3-te+connectivity-91018329; Resistance: 3.3KΩ; Ambient Temperature Range High: +70°C; ComponentLink2URL: https://www.te.com/commerce/DocumentDelivery/DDEController?Action=showdoc&DocId=Data+Sheet%7F1773204-3%7F1%7Fpdf%7FEnglish%7FENG_DS_1773204-3_1.pdf%7F4-2176347-809; Device Class L3: Chip SMD Resistors; Manufacturer Part Number: CRGCQ1206J3K3; ComponentLink2Description: Datasheet; Height: 0.65mm; Lead Free: Yes; Power Rating: 0.25W; Category: Res; Temperature: -55°C to +155°C; Composition: Thick Film; Package: CRGCQ1206; Temperature Range High: +155°C; Voltage Rating: 200V; Temperature Range Low: -55°C; Automotive: Yes; RoHS: TRUE; Series: CRGCQ; Ipc Land Pattern Name: RESC310155X55
U1 U2 = CMP-04918-000633-1: IC REG BUCK 12V 3A TO263-5; Max Input Voltage: 60V; Number of Outputs: 1; Quiescent Current: 5mA; Switching Frequency: 58kHz; Min Supply Voltage: 7V; Efficiency: 88%; Min Input Voltage: 4V; Output Type: Fixed; Synchronous Rectifier: No; Output Current: 3A; Case/Package: TO-263; RoHS Compliant: Yes; Operating Supply Voltage: 60V; Nominal Supply Current: 5mA; Output Voltage: 12V; Mount: Surface Mount; Packaging: Tape and Reel; Package Quantity: 500; Lead Free: Contains Lead; Max Operating Temperature: 125°C; Min Operating Temperature: -40°C; Series: LM2576HV; Radiation Hardening: No; Max Output Current: 3A; Supply Current: 5mA
U3 = CMP-0062-01639-4: 800mA Low-Dropout Linear Regulator, 4-pin SOT-223, Pb-Free; Manufacturer: Texas Instruments; High-Reliability: Y; PowerWise: N; PackageTopMarking: XYTT*N05A; CompType: LDO IC; ComponentLink1URL: http://www.ti.com/general/docs/lit/getliterature.tsp?genericPartNumber=LM1117-N&fileType=pdf; PartNumber: LM1117MPX-3.3/NOPB; ComponentLink1Description: Datasheet URL; PinCount: 4; Code_JEDEC: TO-261-AA; PackageDescription: Molded SOT-223, 6.50 x 3.56 x 1.6mm Body, 4 Lead, 2.3mm Pitch; PackageReference: DCY0004A; RoHS: Y; Code_IPC: SOT223-4